# EAGLE design RS485_Shield_Max13487 (EAGLE 6.5.0)
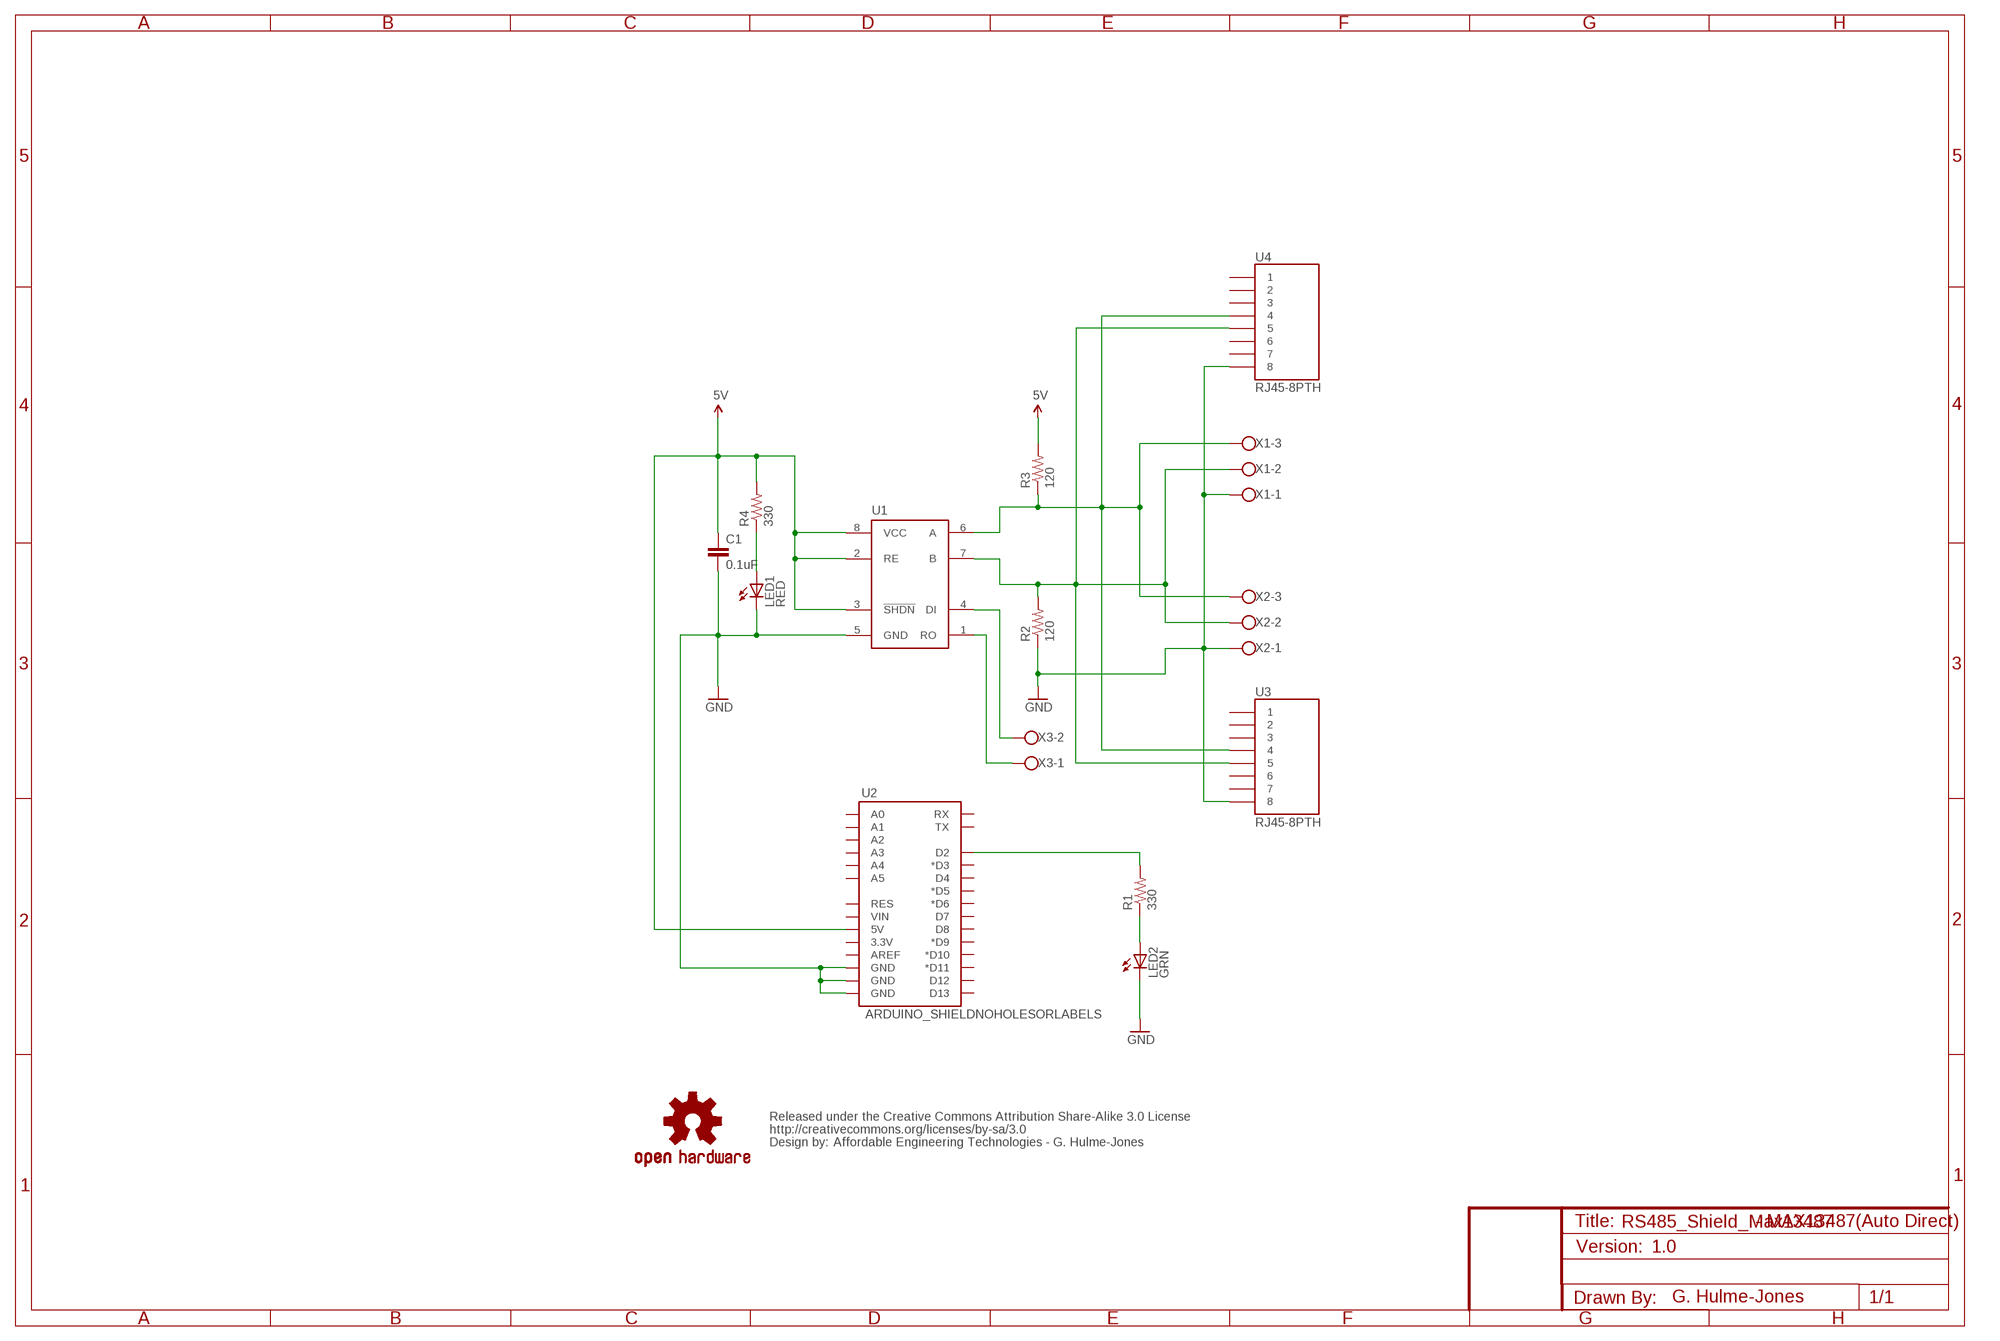
[diagram p0: schematic, sheet 1]

## Parts
C1  0.1uF  CAP0402-CAP  [0402-CAP]
CC_TEXT1  CREATIVE_COMMONS  [CREATIVE_COMMONS]
LED1  RED  LED0603  [LED-0603]
LED2  GRN  LED0603  [LED-0603]
LOGO1  OSHW-LOGOL  [OSHW-LOGO-L]
R1  330  RESISTOR0402-RES  [0402-RES]
R2  120  RESISTOR0402-RES  [0402-RES]
R3  120  RESISTOR0402-RES  [0402-RES]
R4  330  RESISTOR0402-RES  [0402-RES]
U1  MAX13487  MAX13487SOIC  [MAX13487]
U2  ARDUINO_SHIELDNOHOLESORLABELS  [DUEMILANOVE_SHIELD_NOHOLES_NOLABELS]
U3  RJ45-8PTH  [RJ45-8]
U4  RJ45-8PTH  [RJ45-8]
X1  W237-103  [W237-103]
X2  W237-103  [W237-103]
X3  W237-102  [W237-102]

## Nets
5V: C1.1 R3.2 R4.2 U1.2(RE) U1.3(!SHDN) U1.8(VCC) U2.5V
GND: C1.2 LED1.C LED2.C R2.1 U1.5(GND) U2.GND@0(GND) U2.GND@1(GND) U2.GND@2(GND) U3.8 U4.8 X1.1 X2.1
N$1: LED1.A R4.1
N$2: R3.1 U1.6(A) U3.4 U4.4 X1.3 X2.3
N$3: R2.2 U1.7(B) U3.5 U4.5 X1.2 X2.2
N$4: LED2.A R1.1
N$5: R1.2 U2.D2
N$6: U1.4(DI) X3.2
N$7: U1.1(RO) X3.1
Unconnected: U2.3.3V U2.A0 U2.A1 U2.A2 U2.A3 U2.A4 U2.A5 U2.AREF U2.D3(*D3) U2.D4 U2.D5(*D5) U2.D6(*D6) U2.D7 U2.D8 U2.D9(*D9) U2.D10(*D10) U2.D11(*D11) U2.D12 U2.D13 U2.RES U2.RX U2.TX U2.VIN U3.1 U3.2 U3.3 U3.6 U3.7 U4.1 U4.2 U4.3 U4.6 U4.7

## Notes on the sheet
- Affordable Engineering Technologies - G. Hulme-Jones
- - MAX13487(Auto Direct)
- 1.0
- G. Hulme-Jones

## Library data of the parts
C1 = SparkFun-Capacitors:CAP: Capacitor Standard 0603 ceramic capacitor, and 0.1" leaded capacitor.
CC_TEXT1 = SparkFun-Aesthetics:CREATIVE_COMMONS: Creative Commons License summary
LED1 LED2 = SparkFun-LED:LED: LEDs Standard schematic elements and footprints for 5mm, 3mm, 1206, and 0603 sized LEDs. 5mm - Spark Fun Electronics SKU : COM-00529 (and others)
LOGO1 = SparkFun-Aesthetics:OSHW-LOGO: Open Source Hardware Logo This logo indicates the piece of hardware it is found on incorporates a OSHW license and/or adheres to the definition of open source hardware found here: http://freedomdefined.org/OSHW
R1-R4 = SparkFun-Passives:RESISTOR: Resistor Basic schematic elements and footprints for 0603, 1206, and PTH resistors.
U1 = AET:MAX13487
U2 = SparkFun-Boards Edits:ARDUINO_SHIELD: Arduino shield footprint
U3 U4 = SparkFun:RJ45-8: RJ45 Jack Simple RJ45, 8-pin connection - connector for common Cat5, Cat5e, and Cat6 Ethernet cables. Footprint not yet proven in production. Connector sku is PRT-00643; Breakout PCB sku is BOB-00716.
X1 X2 = con-wago-500:W237-103: WAGO SCREW CLAMP; MPN: 237-103; OC_FARNELL: unknown; OC_NEWARK: 18M7116
X3 = con-wago-500:W237-102: WAGO SCREW CLAMP; MPN: 237-102; OC_FARNELL: unknown; OC_NEWARK: 70K9898

## Board
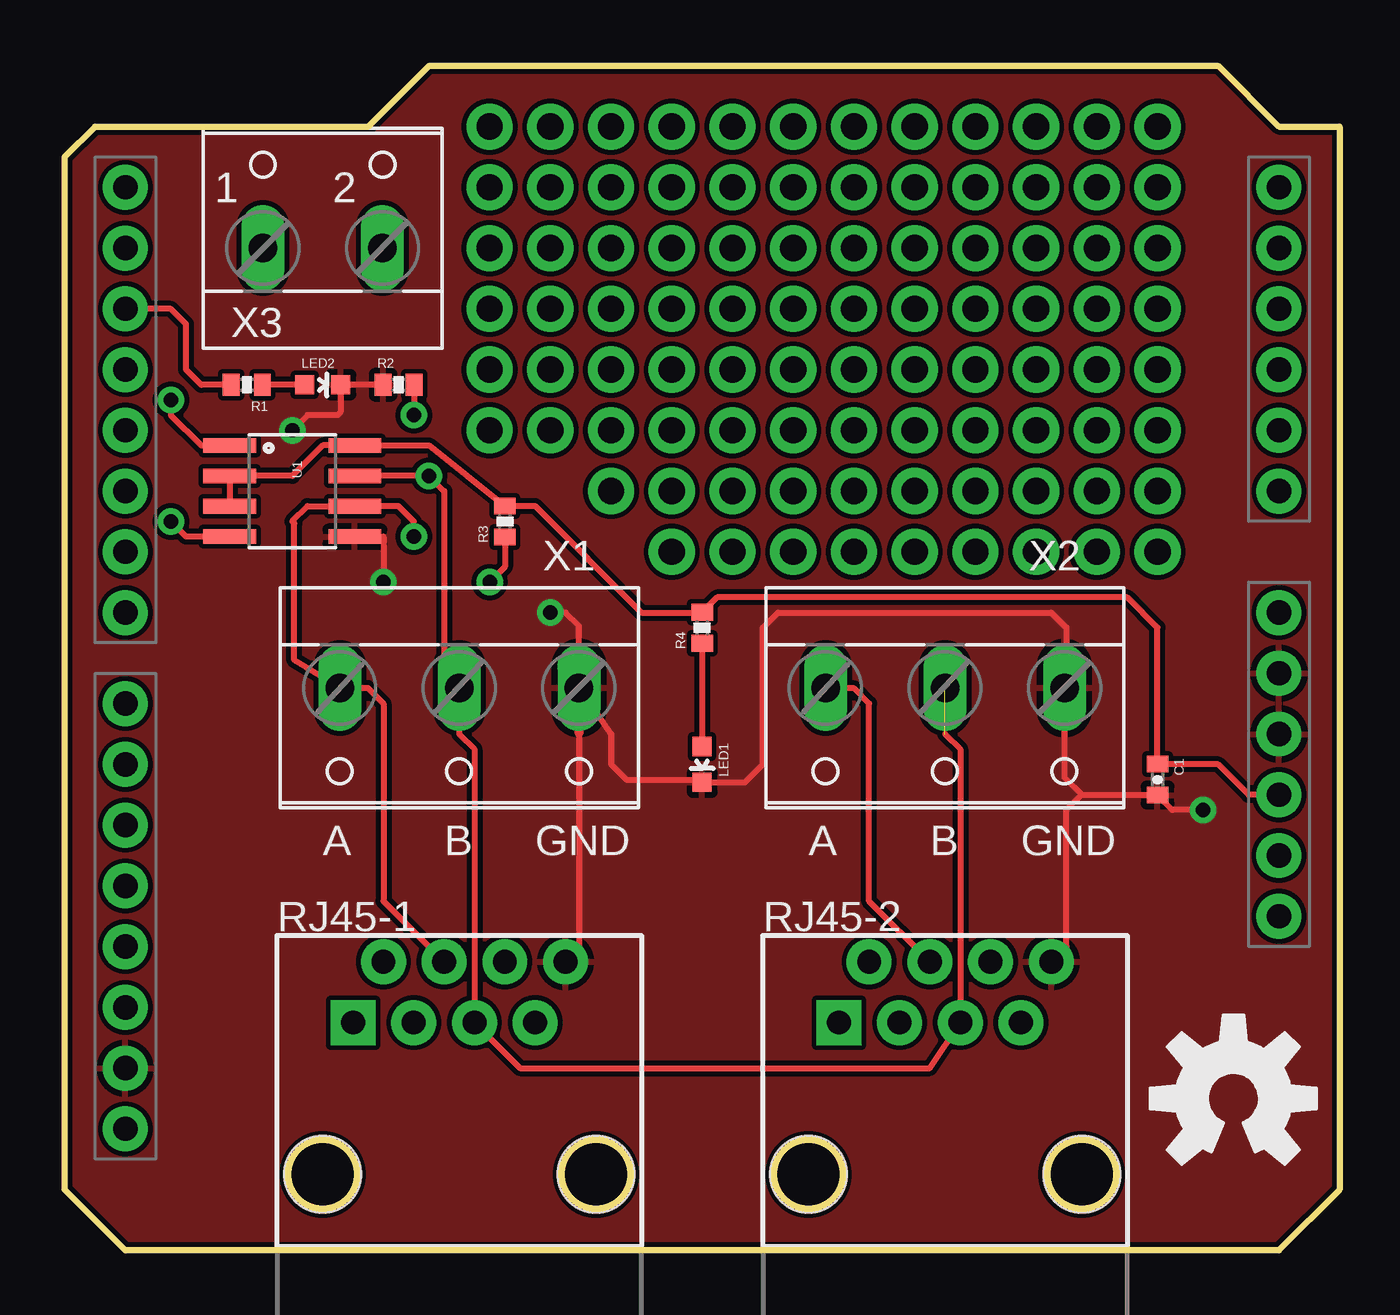
[diagram p1: board, top side]
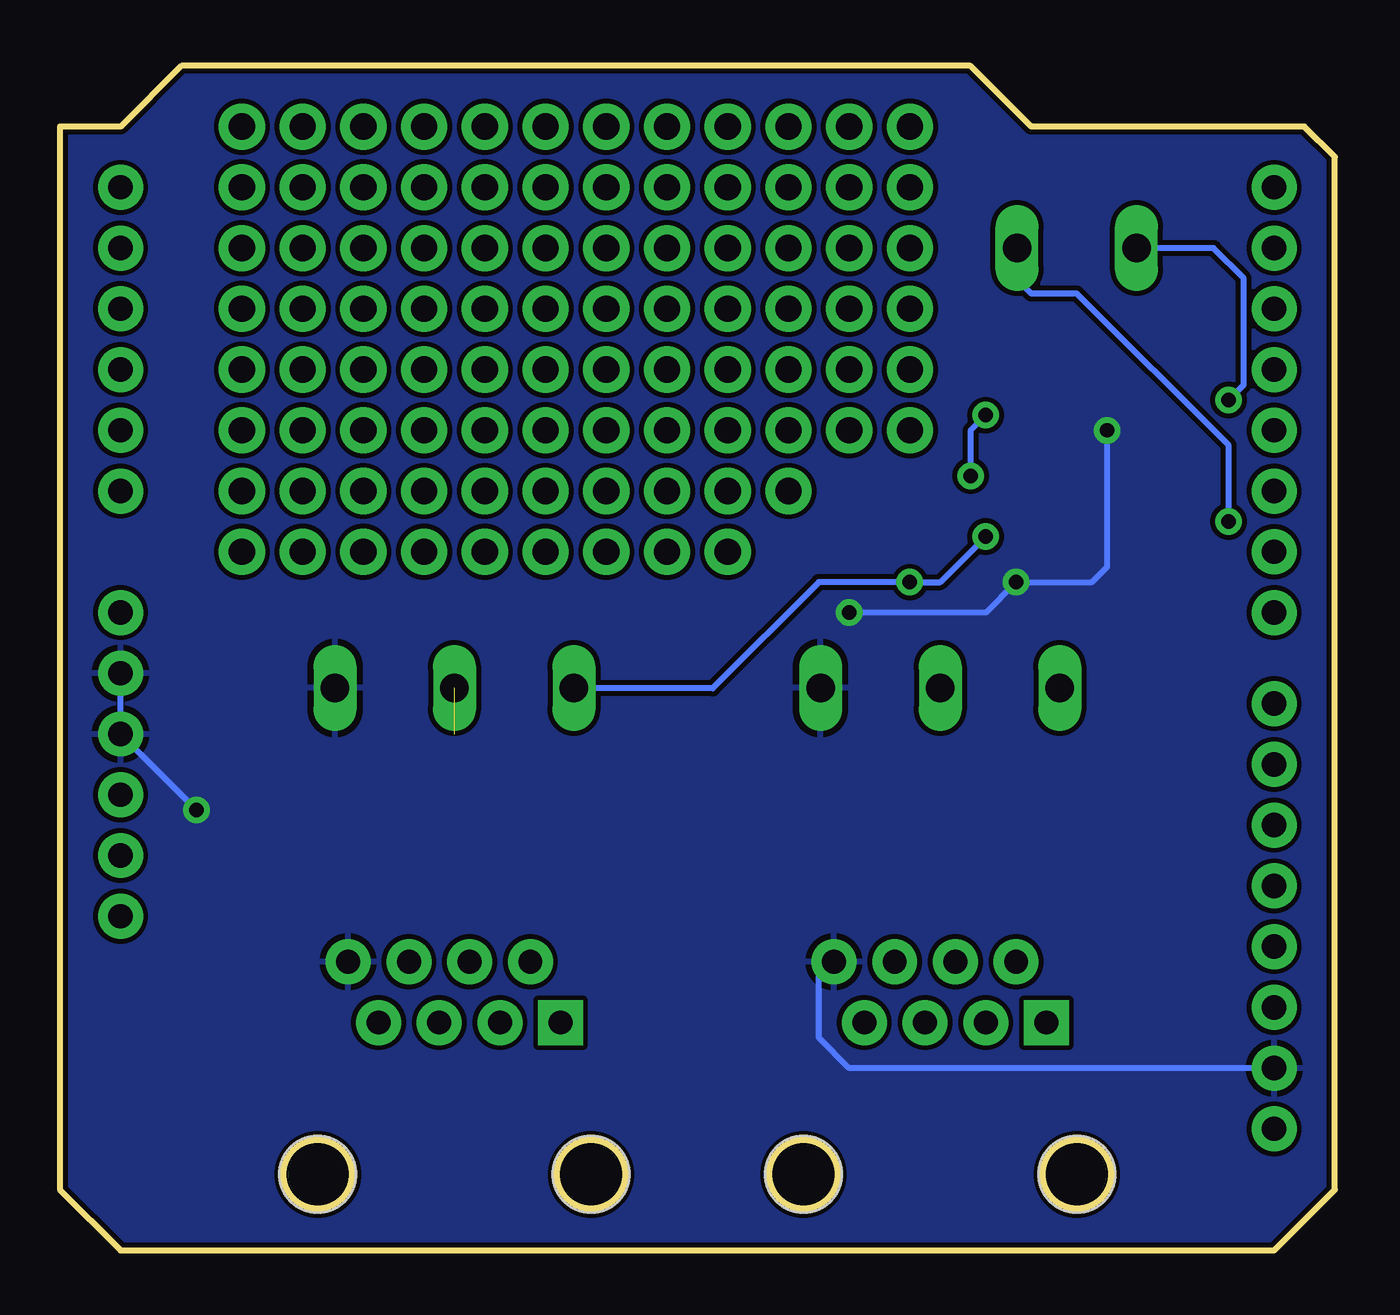
[diagram p2: board, bottom side, seen from below]

Size 53.34 x 49.53 mm. Coordinates in mm from the lower left corner, seen from the top.
Outline: 2.54,0 0,2.54 0,45.72 1.27,46.99 12.7,46.99 15.24,49.53 48.26,49.53 50.8,46.99 53.34,46.99 53.34,2.54 50.8,0 2.54,0
Outline: circle at 10.79,3.17 radius 1.42
Outline: circle at 22.23,3.17 radius 1.42
Outline: circle at 31.11,3.17 radius 1.42
Outline: circle at 42.55,3.17 radius 1.42
Copper layers (1*16): Top 0.035mm / dielectric 1.5mm / Bottom 0.035mm
Design rules "SparkFun": minimum track width 8mil, minimum drill 20mil, track to track 8mil, track to pad 8mil, pad to pad 8mil, via to via 8mil, smd to smd 8mil, copper to edge 8mil, drill to drill 8mil, minimum pad ring 12mil, minimum via ring 10mil, stop-mask expansion 4mil, vias tented up to drill 20mil, thermal gap 10mil

### Footprints (pad centres in the part's own frame; a part is rotated, then mirrored left to right if it is on the bottom)
0402-CAP = smd 0.7 x 0.9: 1 -0.65,0; 2 0.65,0
LED-0603 = smd 0.8 x 0.8: A 0,-0.75; C 0,0.75
0402-RES = smd 0.7 x 0.9: 1 -0.65,0; 2 0.65,0
MAX13487 = smd 0.61 x 2.21: 1 -1.905,-2.616; 2 -0.635,-2.616; 3 0.635,-2.616; 4 1.905,-2.616; 5 1.905,2.616; 6 0.635,2.616; 7 -0.635,2.616; 8 -1.905,2.616
DUEMILANOVE_SHIELD_NOHOLES_NOLABELS = drill 1.016 pad 1.88: 3.3V 50.8,16.51; 5V 50.8,19.05; A0 50.8,31.75; A1 50.8,34.29; A2 50.8,36.83; A3 50.8,39.37; A4 50.8,41.91; A5 50.8,44.45; AREF 2.54,5.08; D2 2.54,39.37; D3 2.54,36.83; D4 2.54,34.29; D5 2.54,31.75; D6 2.54,29.21; D7 2.54,26.67; D8 2.54,22.86; D9 2.54,20.32; D10 2.54,17.78; D11 2.54,15.24; D12 2.54,12.7; D13 2.54,10.16; GND@0 50.8,21.59; GND@1 50.8,24.13; GND@2 2.54,7.62; RES 50.8,13.97; RX 2.54,44.45; TX 2.54,41.91; VIN 50.8,26.67
RJ45-8 = drill 1 pad 1.88 square: 1 -4.445,6.35 | drill 1 pad 1.88: 2 -3.175,8.89; 3 -1.905,6.35; 4 -0.635,8.89; 5 0.635,6.35; 6 1.905,8.89; 7 3.175,6.35; 8 4.445,8.89 | hole 3.2: -5.715,0; 5.715,0
W237-103 = drill 1.194 long: 1 -5,-1.29; 2 0,-1.29; 3 5,-1.29
W237-102 = drill 1.194 long: 1 -2.5,-1.27; 2 2.5,-1.27

### Placement (x,y rotation side)
C1  45.72,19.68 270 top
CC_TEXT1  8.89,-20.32 0 top  (outside the outline)
LED1  26.67,20.32 180 top
LED2  10.79,36.2 270 top
LOGO1  48.9,6.35 0 top
R1  7.62,36.2 180 top
R2  13.97,36.2 0 top
R3  18.41,30.48 90 top
R4  26.67,26.04 90 top
U1  9.53,31.75 270 top
U2  0,0 0 top
U3  36.83,3.17 0 top
U4  16.51,3.17 0 top
X1  16.51,22.23 180 top
X2  36.83,22.23 180 top
X3  10.79,43.18 0 top

### Tracks (layer width: path | path; a pad name or v marks a point on that pad's centre or on a via)
5V
  Top 0.254: U1.3 U1.2 9.53,32.38 10.79,33.66 U1.8 15.24,33.66 18.41,31.11 R3.2 19.67,31.13 24.13,26.67 26.66,26.67 R4.2 27.29,27.3 44.45,27.3 45.72,26.04 C1.1 | U2.5V 49.53,19.05 48.26,20.32 45.73,20.32
  Top 0.406: 45.73,20.32 C1.1
GND  (via drill 0.6)
  Top 0.254: X1.1 21.51,12.62 U4.8 | X1.1 22.84,21.61 22.86,21.59 22.86,20.32 23.5,19.68 26.55,19.68 | R2.1 LED2.C 11.54,35.04 11.43,34.92 10.16,34.92 v9.53,34.29 | LED1.C 28.46,19.57 29.21,20.32 29.21,26.04 29.84,26.67 41.27,26.67 41.91,26.04 41.91,23.59 X2.1 41.83,19.77 42.55,19.05 | v47.62,18.41 46.34,18.41 C1.2 45.7,19.05 42.55,19.05 | X1.1 21.51,26.11 20.95,26.67 v20.32,26.67 | U3.8 41.91,12.7 41.91,18.41 42.55,19.05 | U1.5 13.34,29.84 v13.34,27.94
  Top 0.406: 26.55,19.68 LED1.C | X1.1 21.51,21.67
  Bottom 0.254: U2.GND@2 20.32,7.62 21.59,8.89 21.59,11.43 U4.8 | v47.62,18.41 U2.GND@0 U2.GND@1 | v20.32,26.67 14.61,26.67 v13.34,27.94 10.16,27.94 9.53,28.57 v9.53,34.29
  pour Top: 2.54,0 0,2.54 0,45.72 1.27,46.99 12.7,46.99 15.24,49.53 48.26,49.53 50.8,46.99 53.34,46.99 53.34,2.54 50.8,0
  pour Bottom: 2.54,0 0,2.54 0,45.72 1.27,46.99 12.7,46.99 15.24,49.53 48.26,49.53 50.8,46.99 53.34,46.99 53.34,2.54 50.8,0
N$1
  Top 0.254: R4.1 LED1.A
N$2  (via drill 0.6)
  Top 0.254: X1.3 11.41,23.52 | X1.3 9.61,24.68 9.61,30.4 9.53,30.48 10.16,31.11 U1.6 13.97,31.11 14.61,30.48 v14.61,29.84 | R3.1 18.41,28.57 v17.78,27.94 | X1.3 12.68,23.52 13.34,22.86 13.34,14.61 U4.4 | U3.4 33.66,14.61 33.66,22.86 33.02,23.5 31.85,23.5 X2.3
  Bottom 0.254: v14.61,29.84 16.51,27.94 v17.78,27.94 21.59,27.94 26.04,23.5 31.81,23.5 X2.3
N$3  (via drill 0.6)  (1 unrouted)
  Top 0.254: 36.83,21.59 37.47,20.95 U3.5 36.2,7.62 19.05,7.62 U4.5 17.14,20.95 16.51,21.59 X1.2 15.88,24.15 15.88,31.75 v15.24,32.38 U1.7 | R2.2 14.62,34.94 v14.61,34.92
  Bottom 0.254: v14.61,34.92 15.24,34.29 v15.24,32.38
N$4
  Top 0.254: LED2.A R1.1
N$5
  Top 0.254: R1.2 5.71,36.2 5.08,36.83 5.08,38.73 4.45,39.37 U2.D2
N$6  (via drill 0.6)
  Top 0.254: U1.4 5.08,29.84 v4.45,30.48
  Bottom 0.254: v4.45,30.48 4.45,33.66 10.79,40.01 12.7,40.01 13.34,40.64 13.34,41.87 X3.2
N$7  (via drill 0.6)
  Top 0.254: v4.45,35.56 4.45,34.92 5.71,33.66 U1.1
  Bottom 0.254: v4.45,35.56 3.81,36.2 3.81,40.64 5.08,41.91 X3.1
N$9
  Bottom 0.254: 1.27,46.99 12.7,46.99
N$16  (via drill 1.1 pad 1.93)
  other vias: 45.72,44.45
N$17  (via drill 1.1 pad 1.93)
  other vias: 43.18,44.45
N$18  (via drill 1.1 pad 1.93)
  other vias: 40.64,44.45
N$19  (via drill 1.1 pad 1.93)
  other vias: 38.1,44.45
N$20  (via drill 1.1 pad 1.93)
  other vias: 35.56,44.45
N$21  (via drill 1.1 pad 1.93)
  other vias: 33.02,44.45
N$22  (via drill 1.1 pad 1.93)
  other vias: 30.48,44.45
N$23  (via drill 1.1 pad 1.93)
  other vias: 27.94,44.45
N$24  (via drill 1.1 pad 1.93)
  other vias: 25.4,44.45
N$25  (via drill 1.1 pad 1.93)
  other vias: 22.86,44.45
N$26  (via drill 1.1 pad 1.93)
  other vias: 20.32,44.45
N$27  (via drill 1.1 pad 1.93)
  other vias: 17.78,44.45
N$28  (via drill 1.1 pad 1.93)
  other vias: 17.78,41.91
N$29  (via drill 1.1 pad 1.93)
  other vias: 20.32,41.91
N$30  (via drill 1.1 pad 1.93)
  other vias: 22.86,41.91
N$31  (via drill 1.1 pad 1.93)
  other vias: 25.4,41.91
N$32  (via drill 1.1 pad 1.93)
  other vias: 27.94,41.91
N$33  (via drill 1.1 pad 1.93)
  other vias: 30.48,41.91
N$34  (via drill 1.1 pad 1.93)
  other vias: 33.02,41.91
N$35  (via drill 1.1 pad 1.93)
  other vias: 35.56,41.91
N$36  (via drill 1.1 pad 1.93)
  other vias: 38.1,41.91
N$37  (via drill 1.1 pad 1.93)
  other vias: 40.64,41.91
N$38  (via drill 1.1 pad 1.93)
  other vias: 45.72,41.91
N$39  (via drill 1.1 pad 1.93)
  other vias: 45.72,39.37
N$40  (via drill 1.1 pad 1.93)
  other vias: 43.18,39.37
N$41  (via drill 1.1 pad 1.93)
  other vias: 40.64,39.37
N$42  (via drill 1.1 pad 1.93)
  other vias: 38.1,39.37
N$43  (via drill 1.1 pad 1.93)
  other vias: 35.56,39.37
N$44  (via drill 1.1 pad 1.93)
  other vias: 33.02,39.37
N$45  (via drill 1.1 pad 1.93)
  other vias: 30.48,39.37
N$46  (via drill 1.1 pad 1.93)
  other vias: 27.94,39.37
N$47  (via drill 1.1 pad 1.93)
  other vias: 25.4,39.37
N$48  (via drill 1.1 pad 1.93)
  other vias: 22.86,39.37
N$49  (via drill 1.1 pad 1.93)
  other vias: 20.32,39.37
N$50  (via drill 1.1 pad 1.93)
  other vias: 17.78,39.37
N$51  (via drill 1.1 pad 1.93)
  other vias: 17.78,36.83
N$52  (via drill 1.1 pad 1.93)
  other vias: 20.32,36.83
N$53  (via drill 1.1 pad 1.93)
  other vias: 22.86,36.83
N$54  (via drill 1.1 pad 1.93)
  other vias: 25.4,36.83
N$55  (via drill 1.1 pad 1.93)
  other vias: 27.94,36.83
N$56  (via drill 1.1 pad 1.93)
  other vias: 30.48,36.83
N$57  (via drill 1.1 pad 1.93)
  other vias: 33.02,36.83
N$58  (via drill 1.1 pad 1.93)
  other vias: 35.56,36.83
N$59  (via drill 1.1 pad 1.93)
  other vias: 38.1,36.83
N$60  (via drill 1.1 pad 1.93)
  other vias: 40.64,36.83
N$61  (via drill 1.1 pad 1.93)
  other vias: 43.18,36.83
N$62  (via drill 1.1 pad 1.93)
  other vias: 45.72,36.83
N$63  (via drill 1.1 pad 1.93)
  other vias: 45.72,34.29
N$64  (via drill 1.1 pad 1.93)
  other vias: 45.72,31.75
N$65  (via drill 1.1 pad 1.93)
  other vias: 43.18,31.75
N$66  (via drill 1.1 pad 1.93)
  other vias: 43.18,34.29
N$67  (via drill 1.1 pad 1.93)
  other vias: 40.64,34.29
N$68  (via drill 1.1 pad 1.93)
  other vias: 40.64,31.75
N$69  (via drill 1.1 pad 1.93)
  other vias: 38.1,31.75
N$70  (via drill 1.1 pad 1.93)
  other vias: 38.1,34.29
N$71  (via drill 1.1 pad 1.93)
  other vias: 35.56,34.29
N$72  (via drill 1.1 pad 1.93)
  other vias: 35.56,31.75
N$73  (via drill 1.1 pad 1.93)
  other vias: 33.02,31.75
N$74  (via drill 1.1 pad 1.93)
  other vias: 33.02,34.29
N$75  (via drill 1.1 pad 1.93)
  other vias: 30.48,34.29
N$76  (via drill 1.1 pad 1.93)
  other vias: 30.48,31.75
N$77  (via drill 1.1 pad 1.93)
  other vias: 27.94,31.75
N$78  (via drill 1.1 pad 1.93)
  other vias: 27.94,34.29
N$79  (via drill 1.1 pad 1.93)
  other vias: 25.4,34.29
N$80  (via drill 1.1 pad 1.93)
  other vias: 25.4,31.75
N$81  (via drill 1.1 pad 1.93)
  other vias: 22.86,31.75
N$82  (via drill 1.1 pad 1.93)
  other vias: 22.86,34.29
N$83  (via drill 1.1 pad 1.93)
  other vias: 20.32,34.29
N$84
  Bottom 0.254: 48.26,49.53 50.8,46.99
N$85
  Bottom 0.203: 2.54,0 0,2.54
N$86  (via drill 1.1 pad 1.93)
  other vias: 17.78,34.29
N$89  (via drill 1.1 pad 1.93)
  other vias: 43.18,41.91
N$90  (via drill 1.1 pad 1.93)
  other vias: 45.72,29.21
N$93  (via drill 1.1 pad 1.93)
  other vias: 43.18,29.21
N$94  (via drill 1.1 pad 1.93)
  other vias: 40.64,29.21
N$97  (via drill 1.1 pad 1.93)
  other vias: 38.1,29.21
N$98  (via drill 1.1 pad 1.93)
  other vias: 35.56,29.21
N$101  (via drill 1.1 pad 1.93)
  other vias: 33.02,29.21
N$102  (via drill 1.1 pad 1.93)
  other vias: 30.48,29.21
N$105  (via drill 1.1 pad 1.93)
  other vias: 27.94,29.21
N$106  (via drill 1.1 pad 1.93)
  other vias: 25.4,29.21
N$111  (via drill 1.1 pad 1.93)
  other vias: 17.78,46.99
N$112  (via drill 1.1 pad 1.93)
  other vias: 20.32,46.99
N$113  (via drill 1.1 pad 1.93)
  other vias: 22.86,46.99
N$114  (via drill 1.1 pad 1.93)
  other vias: 25.4,46.99
N$115  (via drill 1.1 pad 1.93)
  other vias: 27.94,46.99
N$116  (via drill 1.1 pad 1.93)
  other vias: 30.48,46.99
N$122  (via drill 1.1 pad 1.93)
  other vias: 33.02,46.99
N$123  (via drill 1.1 pad 1.93)
  other vias: 35.56,46.99
N$124  (via drill 1.1 pad 1.93)
  other vias: 38.1,46.99
N$125  (via drill 1.1 pad 1.93)
  other vias: 40.64,46.99
N$126  (via drill 1.1 pad 1.93)
  other vias: 43.18,46.99
N$127  (via drill 1.1 pad 1.93)
  other vias: 45.72,46.99

### Text on the board
tPlace: A | B | GND | A | B | GND | RJ45-1 | RJ45-2